# EAGLE design claudobip-hdmi-cec (EAGLE 9.6.2)
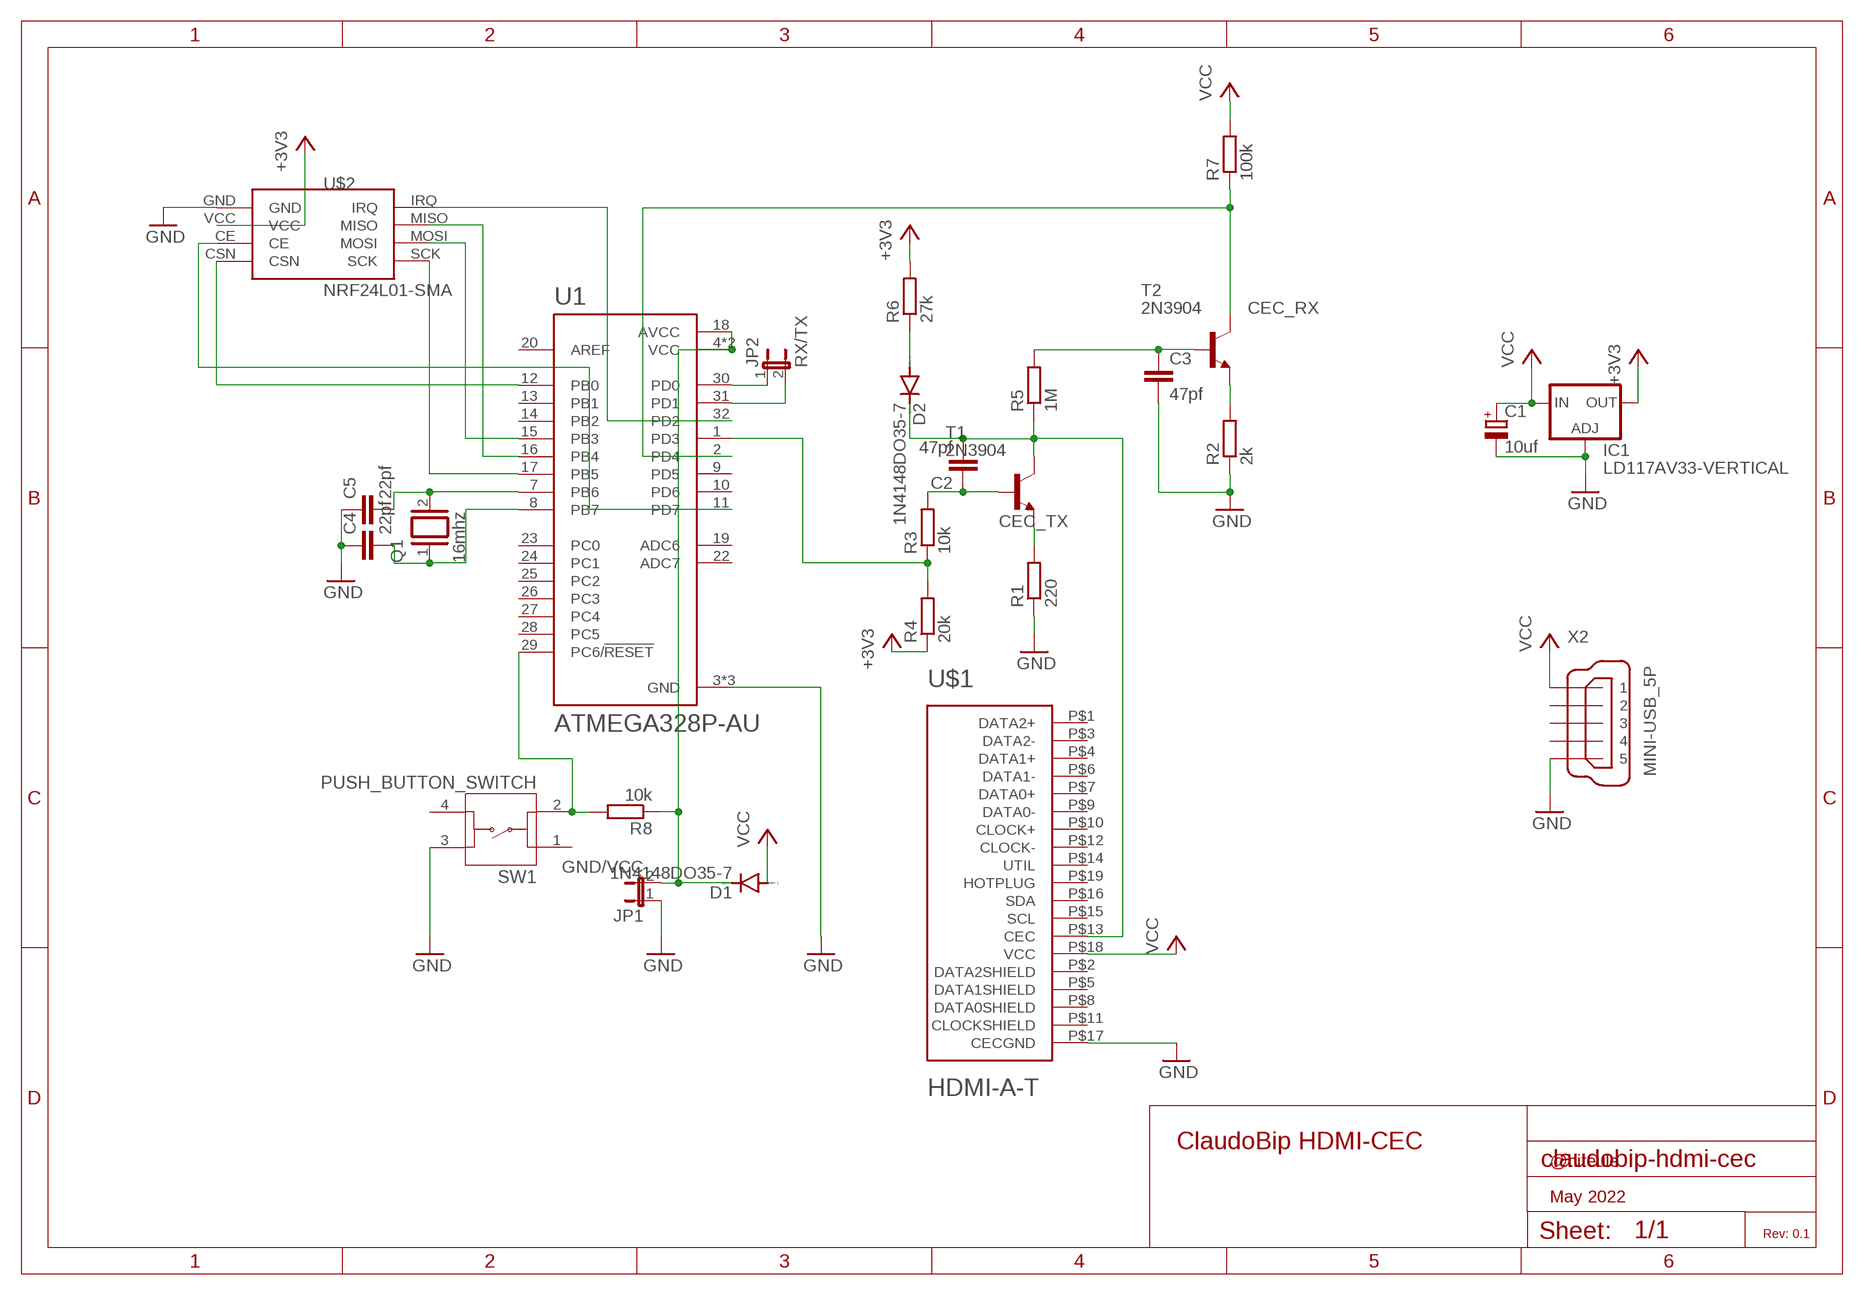
[diagram p0: schematic, sheet 1]

## Parts
C1  10uf  CPOL-EUE2,5-6E  [E2,5-6E]
C2  47pf  C-EU025-024X044  [C025-024X044]
C3  47pf  C-EU025-024X044  [C025-024X044]
C4  22pf  C-EU025-024X044  [C025-024X044]
C5  22pf  C-EU025-024X044  [C025-024X044]
D1  1N4148DO35-7  [DO35-7]
D2  1N4148DO35-7  [DO35-7]
IC1  LD117AV33-VERTICAL  [TO220S-VERTICAL]
JP1  GND/VCC  JP1E  [JP1]
JP2  RX/TX  JP1E  [JP1]
Q1  16mhz  XTAL/S  [QS]
R1  220  R-EU_0204/7  [0204/7]
R2  2k  R-EU_0204/7  [0204/7]
R3  10k  R-EU_0204/7  [0204/7]
R4  20k  R-EU_0204/7  [0204/7]
R5  1M  R-EU_0204/7  [0204/7]
R6  27k  R-EU_0204/7  [0204/7]
R7  100k  R-EU_0204/7  [0204/7]
R8  10k  R-EU_0204/7  [0204/7]
SW1  PUSH_BUTTON_SWITCH  [PUSH_BUTTON_SWITCH]
T1  2N3904  [TO92]
T2  2N3904  [TO92]
U1  ATMEGA328P-AU  [QFP80P900X900X120-32N]
U$1  HDMI-A-T  [HDMI_A-T]
U$2  NRF24L01-SMA  [NRF24L01-SMA]
X2  MINI-USB_5P  [MINI-USB_5P]

## Nets
+3V3: IC1.2(OUT) R4.1 R6.2 U$2.VCC
CEC_RX: R7.1 T2.1(C) U1.2(PD4)
CEC_TX: C2.1 R3.2 T1.2(B)
GND: C1.- C3.2 C4.1 C5.1 IC1.1(ADJ) JP1.1 R1.1 R2.1 SW1.3 U1.3(GND) U1.5(GND) U1.21(GND) U$1.P$17(CECGND) U$2.GND X2.5
N$1: R1.2 T1.3(E)
N$2: C5.2 Q1.2 U1.7(PB6)
N$3: C4.2 Q1.1 U1.8(PB7)
N$4: R8.2 SW1.2 U1.29(PC6/!RESET)
N$5: D1.C JP1.2 R8.1 U1.4(VCC) U1.6(VCC) U1.18(AVCC)
N$6: U1.16(PB4) U$2.MISO
N$7: U1.15(PB3) U$2.MOSI
N$8: U1.12(PB0) U$2.CSN
N$9: U1.11(PD7) U$2.CE
N$10: U1.32(PD2) U$2.IRQ
N$11: U1.17(PB5) U$2.SCK
N$12: JP2.1 U1.30(PD0)
N$13: JP2.2 U1.31(PD1)
N$14: R2.2 T2.3(E)
N$16: C3.1 R5.2 T2.2(B)
N$17: R3.1 R4.2 U1.1(PD3)
N$18: C2.2 D2.C R5.1 T1.1(C) U$1.P$13(CEC)
N$19: D2.A R6.1
VCC: C1.+ D1.A IC1.3(IN) R7.2 U$1.P$18(VCC) X2.1
Unconnected: SW1.1 SW1.4 U1.9(PD5) U1.10(PD6) U1.13(PB1) U1.14(PB2) U1.19(ADC6) U1.20(AREF) U1.22(ADC7) U1.23(PC0) U1.24(PC1) U1.25(PC2) U1.26(PC3) U1.27(PC4) U1.28(PC5) U$1.P$1(DATA2+) U$1.P$2(DATA2SHIELD) U$1.P$3(DATA2-) U$1.P$4(DATA1+) U$1.P$5(DATA1SHIELD) U$1.P$6(DATA1-) U$1.P$7(DATA0+) U$1.P$8(DATA0SHIELD) U$1.P$9(DATA0-) U$1.P$10(CLOCK+) U$1.P$11(CLOCKSHIELD) U$1.P$12(CLOCK-) U$1.P$14(UTIL) U$1.P$15(SCL) U$1.P$16(SDA) U$1.P$19(HOTPLUG) X2.2 X2.3 X2.4

## Notes on the sheet
- ClaudoBip HDMI-CEC
- @hiteule
- May 2022
- Rev: 0.1

## Library data of the parts
C1 = rcl:CPOL-EU: POLARIZED CAPACITOR, European symbol; SPICEPREFIX: C
C2-C5 = rcl:C-EU: CAPACITOR, European symbol; SPICEPREFIX: C
D1 D2 = diode:1N4148: DIODE high speed (Philips)
IC1 = regulator:LD117AV33-VERTICAL
JP1 JP2 = jumper:JP1E: JUMPER
Q1 = special:XTAL/S: CRYSTAL
R1-R8 = rcl:R-EU_: RESISTOR, European symbol; SPICEPREFIX: R
SW1 = CONNECTORS:PUSH_BUTTON_SWITCH: Push button switch
T1 T2 = transistor:2N3904: NPN TRANSISTOR
U1 = ATMEGA328P-AU:ATMEGA328P-AU: ATmega Series 20 MHz 32 KB Flash 2 KB SRAM 8-Bit Microcontroller - TQFP-32 Check availability <https://pricing.snapeda.com/parts/ATMEGA328P-AU/Microchip%20Technology/view-part?ref=eda>; AVAILABILITY: In Stock; DESCRIPTION: AVR AVR® ATmega Microcontroller IC 8-Bit 20MHz 32KB (16K x 16) FLASH 32-TQFP (7x7); MF: Microchip Technology; MP: ATMEGA328P-AU; PACKAGE: TQFP-32 Microchip; PRICE: None; PURCHASE-URL: https://pricing.snapeda.com/search/part/ATMEGA328P-AU/?ref=eda
U$1 = CONNECTORS:HDMI-A-T: Horizonal HDMI type "A" jack
U$2 = NRF24L01:NRF24L01-SMA: NRF24L01 module with a SMA connector
X2 = CONNECTORS:MINI-USB_5P: MINI USB-B 5pol.

## Board
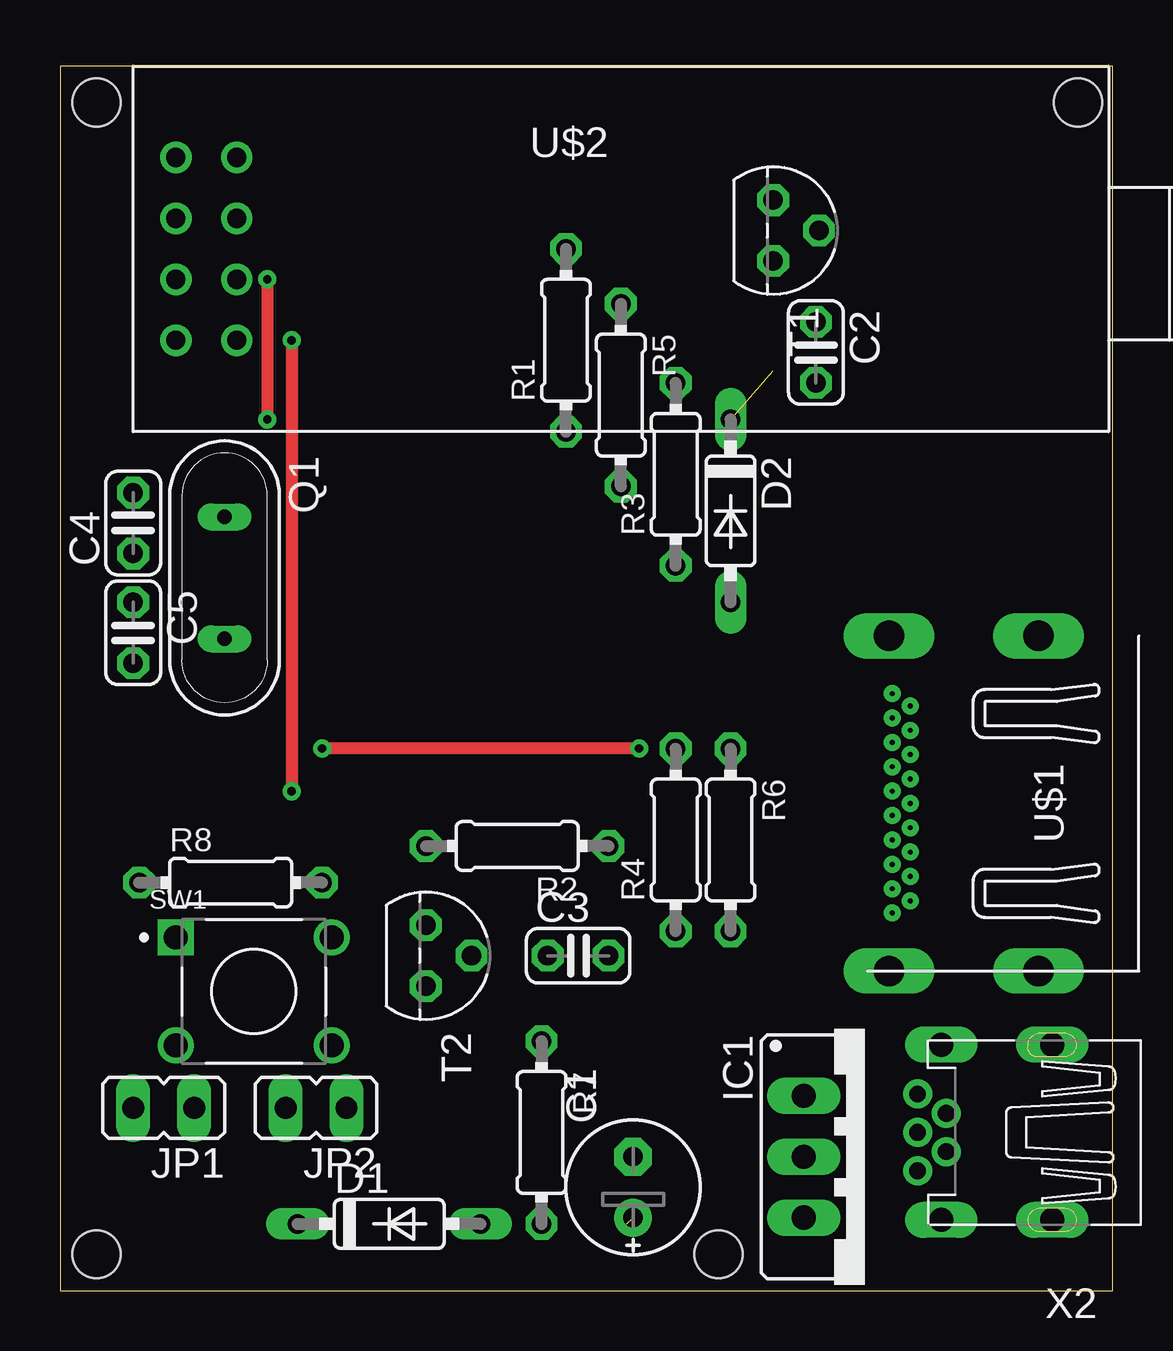
[diagram p1: board, top side]
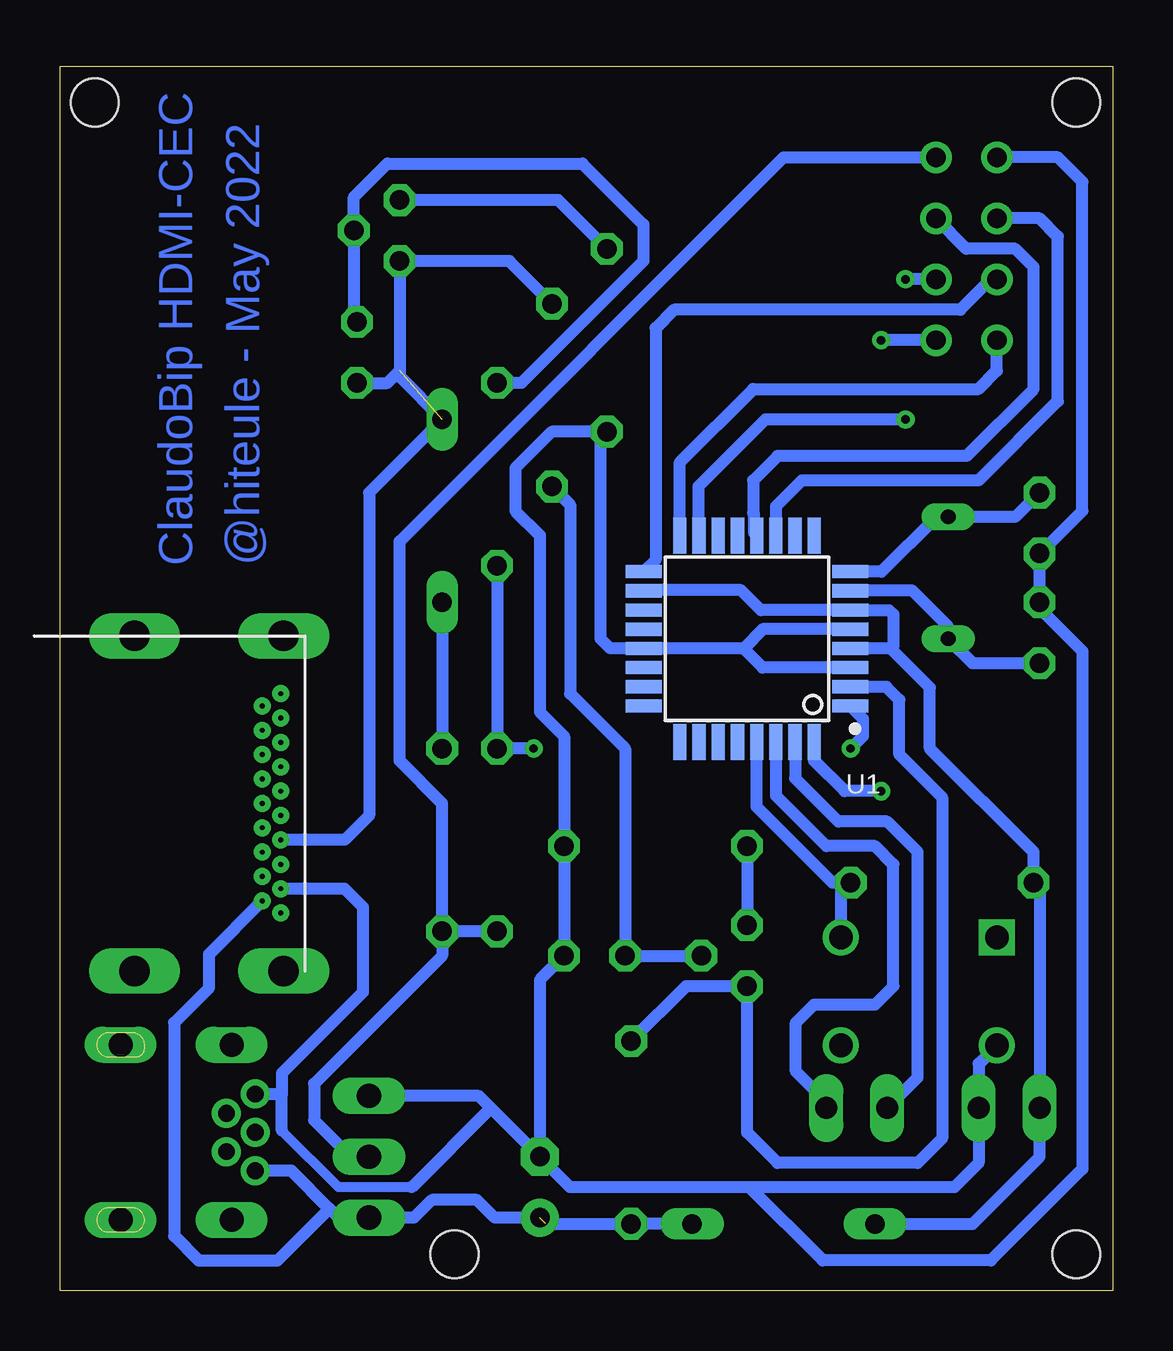
[diagram p2: board, bottom side, seen from below]

Size 43.87 x 51.04 mm. Coordinates in mm from the lower left corner, seen from the top.
Outline: 0,0 43.87,0 43.87,51.04 0,51.04 0,0
Copper layers (1*16): Top 0.035mm / dielectric 1.5mm / Bottom 0.035mm
Design rules "default": minimum track width 6mil, minimum drill 0.35mm, track to track 6mil, track to pad 6mil, pad to pad 6mil, via to via 6mil, smd to smd 6mil, copper to edge 40mil, drill to drill 6mil, minimum pad ring 10mil, minimum via ring 8mil, stop-mask expansion 4mil, vias tented up to drill 0mil, thermal gap 10mil
Holes 2 mm at 1.52,49.53 27.43,1.52 1.52,1.52 42.42,49.53

### Footprints (pad centres in the part's own frame; a part is rotated, then mirrored left to right if it is on the bottom)
E2,5-6E = drill 0.813 pad 1.575: + -1.27,0 | drill 0.813 pad 1.575 octagon: - 1.27,0
C025-024X044 = drill 0.813 octagon: 1 -1.27,0; 2 1.27,0
DO35-7 = drill 0.813 long: A 3.81,0; C -3.81,0
TO220S-VERTICAL = drill 1.016 long: 1 -2.54,-2.54; 2 0,-2.54; 3 2.54,-2.54
JP1 = drill 0.914 long: 1 0,-1.27; 2 0,1.27
QS = drill 0.61 long: 1 -2.54,0; 2 2.54,0
0204/7 = drill 0.813 octagon: 1 -3.81,0; 2 3.81,0
PUSH_BUTTON_SWITCH = drill 0.99 square: 1 0,0 | drill 0.99: 2 6.5,0; 3 0,-4.5; 4 6.5,-4.5
TO92 = drill 0.813 octagon: 1 1.27,0; 2 0,1.905; 3 -1.27,0
QFP80P900X900X120-32N = smd 1.5 x 0.55: 1 -4.3,2.8; 2 -4.3,2; 3 -4.3,1.2; 4 -4.3,0.4; 5 -4.3,-0.4; 6 -4.3,-1.2; 7 -4.3,-2; 8 -4.3,-2.8; 17 4.3,-2.8; 18 4.3,-2; 19 4.3,-1.2; 20 4.3,-0.4; 21 4.3,0.4; 22 4.3,1.2; 23 4.3,2; 24 4.3,2.8 | smd 0.55 x 1.5: 9 -2.8,-4.3; 10 -2,-4.3; 11 -1.2,-4.3; 12 -0.4,-4.3; 13 0.4,-4.3; 14 1.2,-4.3; 15 2,-4.3; 16 2.8,-4.3; 25 2.8,4.3; 26 2,4.3; 27 1.2,4.3; 28 0.4,4.3; 29 -0.4,4.3; 30 -1.2,4.3; 31 -2,4.3; 32 -2.8,4.3
HDMI_A-T = drill 0.2: P$1 4.572,4.445; P$2 4.064,3.683; P$3 3.556,4.445; P$4 3.048,3.683; P$5 2.54,4.445; P$6 2.032,3.683; P$7 1.524,4.445; P$8 1.016,3.683; P$9 0.508,4.445; P$10 0,3.683; P$11 -0.508,4.445; P$12 -1.016,3.683; P$13 -1.524,4.445; P$14 -2.032,3.683; P$15 -2.54,4.445; P$16 -3.048,3.683; P$17 -3.556,4.445; P$18 -4.064,3.683; P$19 -4.572,4.445 | drill 1.27 pad 1.524 long: P$20 6.985,4.572; P$21 6.985,-1.651; P$23 -6.985,-1.651; P$24 -6.985,4.572
NRF24L01-SMA = drill 0.8: CE -18.542,1.27; CSN -16.002,1.27; GND -18.542,3.81; IRQ -16.002,-3.81; MISO -18.542,-3.81; MOSI -16.002,-1.27; SCK -18.542,-1.27; VCC -16.002,3.81
MINI-USB_5P = drill 0.7 pad 1.016: 1 3.384,1.6; 2 2.184,0.8; 3 3.384,0; 4 2.184,-0.8; 5 3.384,-1.6 | drill 1 pad 1.422 long: M1 -2.225,3.65; M2 -2.225,-3.65; M3 2.398,3.65; M4 2.398,-3.65

### Placement (x,y rotation side)
C1  23.88,4.32 90 top
C2  31.5,39.12 270 top
C3  21.59,13.97 0 top
C4  3.05,32 90 top
C5  3.05,27.43 270 top
D1  13.72,2.79 0 top
D2  27.94,32.51 270 top
IC1  33.53,5.59 270 top
JP1  4.32,7.62 90 top
JP2  10.67,7.62 90 top
Q1  6.86,29.72 270 top
R1  21.08,39.62 90 top
R2  19.05,18.54 180 top
R3  25.65,34.04 90 top
R4  25.65,18.8 90 top
R5  23.37,37.34 270 top
R6  27.94,18.8 270 top
R7  20.07,6.6 270 top
R8  7.11,17.02 0 top
SW1  4.83,14.73 0 top
T1  29.72,44.2 270 top
T2  15.24,13.97 270 top
U1  15.24,27.18 180 bottom
U$1  39.12,20.32 90 top
U$2  23.37,43.43 0 top
X2  39.12,6.6 180 top

### Tracks (layer width: path | path; a pad name or v marks a point on that pad's centre or on a via)
+3V3
  Bottom 0.508: R6.2 27.94,20.32 29.72,22.1 29.72,31.24 13.72,47.24 U$2.VCC | R4.1 R6.2 | R6.2 27.94,13.97 33.27,8.64 33.27,7.11 31.75,5.59 IC1.2
CEC_RX
  Bottom 0.508: R7.1 17.78,12.7 T2.1 15.24,6.6 13.97,5.33 8.13,5.33 7.11,6.35 7.11,20.57 8.89,22.35 8.89,24.64 9.43,25.18 U1.2
CEC_TX
  Bottom 0.508: C2.1 31.62,40.51 T1.2 31.62,45.59 30.23,46.99 22.1,46.99 19.56,44.45 19.56,42.93 24.64,37.85 R3.2
GND
  Bottom 0.406: 29.21,4.32 32.26,4.32 34.62,6.68
  Bottom 0.508: SW1.3 5.59,9.47 JP1.1 5.59,5.33 6.6,4.32 15.14,4.32 | 15.14,4.32 22.61,4.32 C1.- | 15.14,4.32 12.09,1.27 5.08,1.27 1.27,5.08 1.27,26.67 3.05,28.45 C5.1 C4.1 1.27,32.51 1.27,46.23 2.29,47.24 U$2.GND | 34.98,8.2 X2.5 34.62,8.2 | U$1.P$17 32,16.76 31.24,16 31.24,12.45 34.62,9.07 34.62,8.2 | U1.5 14.59,27.58 15.39,26.78 | 15.39,26.78 U1.21 20.94,26.78 21.34,27.18 21.34,35.56 R1.1 23.37,35.81 24.89,34.29 24.89,32.51 23.88,31.5 23.88,24.13 22.86,23.11 R2.1 C3.2 23.88,12.95 C1.- | U1.3 14.59,25.98 15.39,26.78 | C1.- 25.91,7.62 | 25.91,7.62 26.42,8.13 IC1.1 | 34.62,6.68 34.62,8.2 | 25.91,7.62 29.21,4.32
N$1
  Bottom 0.508: R1.2 23.11,45.47 T1.3
N$2
  Bottom 0.508: U1.7 10.91,29.21 8.38,29.21 6.86,27.69 Q1.2 5.84,26.16 C5.2
N$3
  Bottom 0.508: U1.8 9.65,29.98 7.37,32.26 Q1.1 4.06,32.26 C4.2
N$4
  Bottom 0.508: SW1.2 11.33,16.61 R8.2 11.68,17.02 14.84,20.17 U1.29
N$5
  Bottom 0.508: 9.25,26.78 7.62,25.15 7.62,22.61 3.3,18.29 R8.1 3.05,16.76 JP1.2 3.05,5.59 5.84,2.79 D1.C | 9.25,26.78 U1.4 | 9.25,26.78 9.14,26.89 9.14,28.19 9.33,28.38 U1.6 14.66,28.38 15.49,29.21 19.51,29.21 U1.18
N$6
  Bottom 0.508: U1.16 18.04,34.54 14.99,37.59 5.59,37.59 4.83,38.35 U$2.MISO
N$7  (via drill 0.35)
  Top 0.508: v8.64,42.16 v8.64,36.32
  Bottom 0.508: U$2.MOSI v8.64,42.16 | U1.15 17.27,31.51 17.27,33.53 14.48,36.32 v8.64,36.32
N$8
  Bottom 0.508: U$2.CSN 6.1,43.43 4.06,43.43 3.3,42.67 3.3,37.59 6.1,34.8 13.97,34.8 14.99,33.78 14.99,32.42 14.96,32.4 14.96,31.6 U1.12
N$9
  Bottom 0.508: U1.11 14.04,32.7 12.95,33.78 5.59,33.78 2.29,37.08 2.29,43.94 3.05,44.7 U$2.CE
N$10  (via drill 0.35)
  Top 0.508: v9.65,39.62 v9.65,20.83
  Bottom 0.508: U$2.IRQ v9.65,39.62 | v9.65,20.83 11.18,20.83 12.44,22.09 U1.32
N$11
  Bottom 0.508: U$2.SCK 5.08,42.16 6.35,40.89 18.29,40.89 19.05,40.13 19.05,30.47 U1.17
N$12
  Bottom 0.508: U1.30 14.04,20.64 11.94,18.54 9.91,18.54 9.14,17.78 9.14,12.7 9.91,11.94 12.45,11.94 13.21,11.18 13.21,9.14 11.94,7.87 JP2.1
N$13
  Bottom 0.508: U1.31 13.24,21.37 11.43,19.56 9.4,19.56 8.13,18.29 8.13,8.89 JP2.2
N$14
  Bottom 0.508: R2.2 T2.3
N$16
  Bottom 0.508: T2.2 C3.1 20.32,22.61 22.61,24.89 22.61,32.77 R5.2
N$17  (via drill 0.35)
  Top 0.508: v24.13,22.61 v10.92,22.61
  Bottom 0.508: 10.92,24.36 U1.1 10.41,23.85 10.41,23.11 v10.92,22.61 | v24.13,22.61 R4.2 R3.1
N$18  (1 unrouted)
  Bottom 0.508: C2.2 30.23,37.85 29.72,38.35 | R5.1 25.15,42.93 T1.1 29.72,38.1 D2.C 30.99,33.27 30.99,19.81 32,18.8 U$1.P$13
N$19
  Bottom 0.508: D2.A R6.1
VCC  (1 unrouted)
  Bottom 0.508: D1.A R7.2 23.62,2.79 | U$1.P$18 37.66,14.03 37.66,12.64 39.12,11.18 39.12,2.29 38.1,1.27 34.8,1.27 32.64,3.43 | X2.1 34.21,5 32.64,3.43 | 32.64,3.43 32.26,3.05 IC1.3 29.12,3.05 28.37,3.79 26.49,3.79 25.75,3.05 C1.+

### Text on the board
Bottom: @hiteule - May 2022 | ClaudoBip HDMI-CEC